# Altium schematic sheet EthIO_03_Ethernet.SchDoc
size A4; SheetNumber: 7; SheetTotal: 8
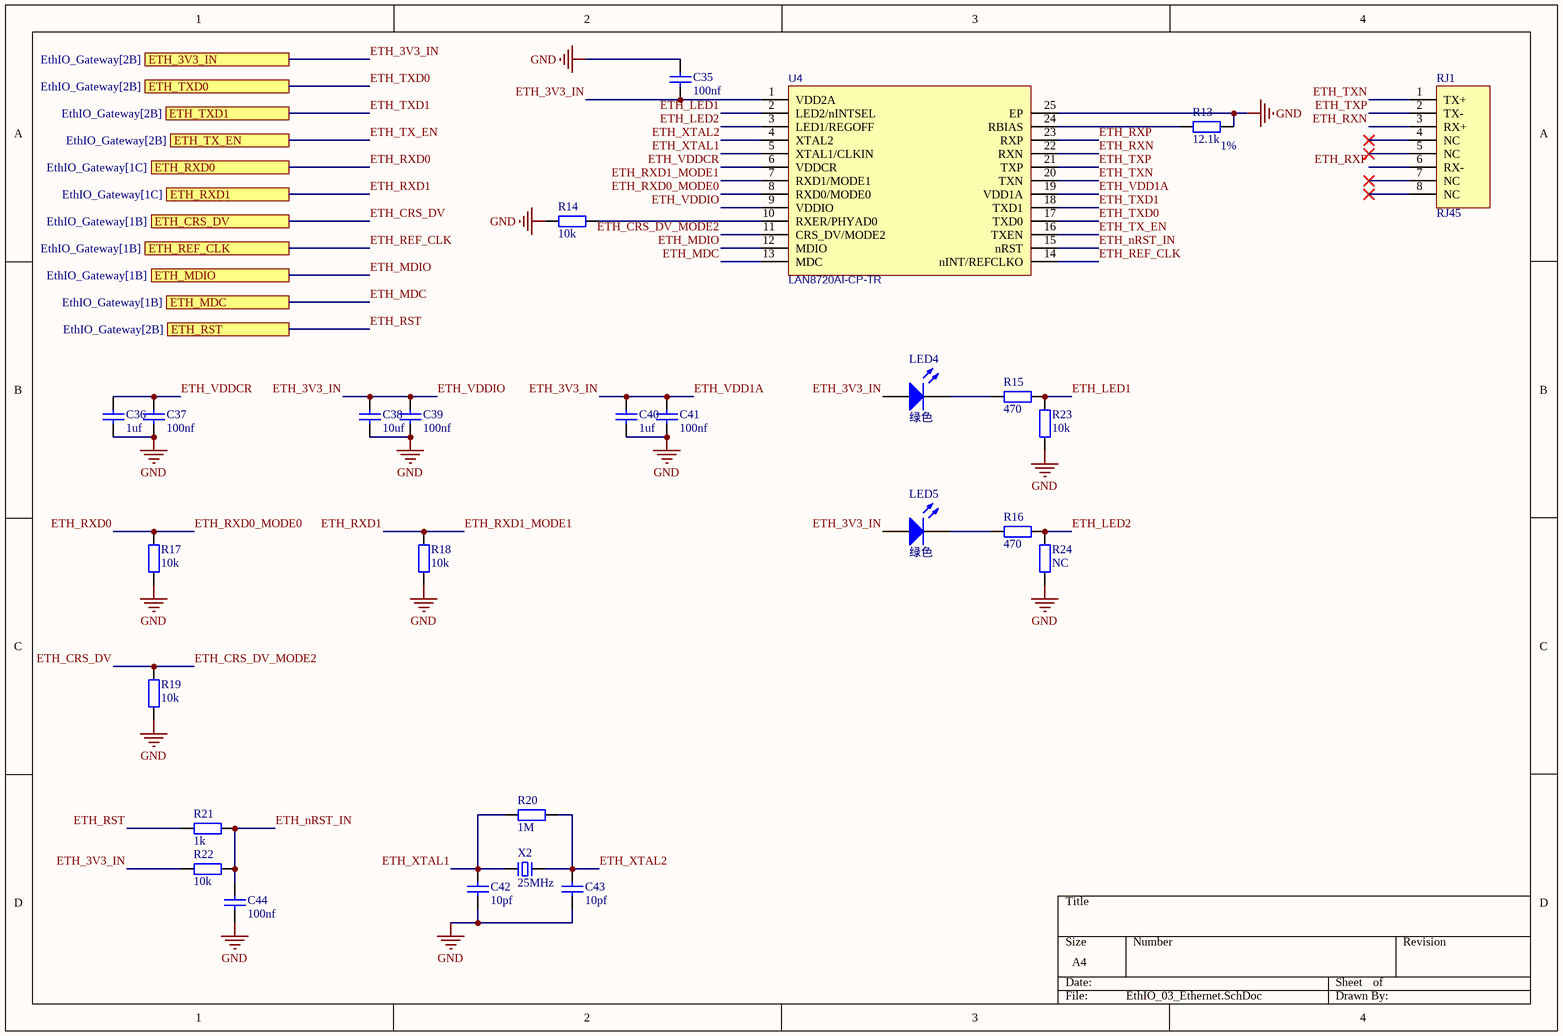
[diagram p0: EthIO_03_Ethernet.SchDoc]

## Parts
C35  100nf  [C0805_L]
C36  1uf  [C0805_L]
C37  100nf  [C0805_L]
C38  10uf  [C0805_L]
C39  100nf  [C0805_L]
C40  1uf  [C0805_L]
C41  100nf  [C0805_L]
C42  10pf  [C0805_L]
C43  10pf  [C0805_L]
C44  100nf  [C0805_L]
LED4  绿色  [LED0805_G]
LED5  绿色  [LED0805_G]
R13  12.1k  Tolerance: 1%  [R0805_L]
R14  10k  [R0805_L]
R15  470  [R0805_L]
R16  470  [R0805_L]
R17  10k  [R0805_L]
R18  10k  [R0805_L]
R19  10k  [R0805_L]
R20  1M  [R0805_L]
R21  1k  [R0805_L]
R22  10k  [R0805_L]
R23  10k  [R0805_L]
R24  NC  [R0805_L]
RJ1  RJ45  [RJ45-2]
U4  LAN8720AI-CP-TR  [QFN24 4x4_N]
X2  25MHz  [HC-49S]

## Ports
ETH_3V3_IN (see EthIO_Gateway[2B]), ETH_CRS_DV (see EthIO_Gateway[1B]), ETH_MDC (see EthIO_Gateway[1B]), ETH_MDIO (see EthIO_Gateway[1B]), ETH_REF_CLK (see EthIO_Gateway[1B]), ETH_RST (see EthIO_Gateway[2B]), ETH_RXD0 (see EthIO_Gateway[1C]), ETH_RXD1 (see EthIO_Gateway[1C]), ETH_TX_EN (see EthIO_Gateway[2B]), ETH_TXD0 (see EthIO_Gateway[2B]), ETH_TXD1 (see EthIO_Gateway[2B])

## Nets
GND: C35.1 C36.2 C37.2 C38.2 C39.2 C40.2 C41.2 C42.2 C43.2 C44.2 R13.1 R14.2 R17.1 R18.1 R19.1 R23.1 R24.1 U4.25(EP)
ETH_3V3_IN: C35.2 C38.1 C39.1 C40.1 C41.1 LED4.1(A) LED5.1(A) R22.1 U4.1(VDD2A) U4.9(VDDIO) U4.19(VDD1A) ; port ETH_3V3_IN  [also labelled ETH_VDD1A, ETH_VDDIO]
ETH_CRS_DV: R19.2 U4.11(CRS_DV/MODE2) ; port ETH_CRS_DV  [also labelled ETH_CRS_DV_MODE2]
ETH_LED1: R15.1 R23.2 U4.2(LED2/nINTSEL)
ETH_LED2: R16.1 R24.2 U4.3(LED1/REGOFF)
ETH_MDC: U4.13(MDC) ; port ETH_MDC
ETH_MDIO: U4.12(MDIO) ; port ETH_MDIO
ETH_nRST_IN: C44.1 R21.2 R22.2 U4.15(nRST)
ETH_REF_CLK: U4.14(nINT/REFCLKO) ; port ETH_REF_CLK
ETH_RST: R21.1 ; port ETH_RST
ETH_RXD0: R17.2 U4.8(RXD0/MODE0) ; port ETH_RXD0  [also labelled ETH_RXD0_MODE0]
ETH_RXD1: R18.2 U4.7(RXD1/MODE1) ; port ETH_RXD1  [also labelled ETH_RXD1_MODE1]
ETH_RXN: RJ1.3(RX+) U4.22(RXN)
ETH_RXP: RJ1.6(RX-) U4.23(RXP)
ETH_TX_EN: U4.16(TXEN) ; port ETH_TX_EN
ETH_TXD0: U4.17(TXD0) ; port ETH_TXD0
ETH_TXD1: U4.18(TXD1) ; port ETH_TXD1
ETH_TXN: RJ1.1(TX+) U4.20(TXN)
ETH_TXP: RJ1.2(TX-) U4.21(TXP)
ETH_VDDCR: C36.1 C37.1 U4.6(VDDCR)
ETH_XTAL1: C42.1 R20.1 U4.5(XTAL1/CLKIN) X2.1
ETH_XTAL2: C43.1 R20.2 U4.4(XTAL2) X2.2
NetLED4_2: LED4.2(K) R15.2
NetLED5_2: LED5.2(K) R16.2
NetR13_2: R13.2 U4.24(RBIAS)
NetR14_1: R14.1 U4.10(RXER/PHYAD0)

Not connected (* = marked no-connect by the designer): RJ1 4(NC)* 5(NC)* 7(NC)* 8(NC)*

## Library data of the parts
C35-C44 = C: 贴片电容/MLCC电容; BOM名称: 无极性贴片电容; 当前库版本V2022.12.25 @淘宝卖家:黄晶宝石: 最新版本发布https://shop463601444.taobao.com
LED4 LED5 = LED: 贴片LED; 封装库来自淘宝卖家：黄晶宝石: 其他店铺购入均为盗版封装库，无更新权益，请立即申请退款，本店现金奖励200~1000元; BOM名称: 贴片LED
R13 = R: 贴片电阻; BOM名称: 贴片电阻
R14-R24 = R: 贴片电阻; 联系下单店铺卖家 免费帮你查找封装: 联系下单店铺卖家 免费技术支持; BOM名称: 贴片电阻
RJ1 = RJ45: 以太网接口; 当前库版本V2022.12.25 @淘宝卖家:黄晶宝石: 最新版本发布https://shop463601444.taobao.com; BOM名称: 以太网接口
U4 = LAN8720AI-CP-TR: 100M 以太网PHY; 芯片厂商: SMSC; 封装库来自淘宝卖家：黄晶宝石: 其他店铺购入均为盗版封装库，无更新权益，退款现金奖励200~1000元; 当前库版本V2022.12.25 @淘宝卖家:黄晶宝石: 最新版本发布https://shop463601444.taobao.com
X2 = XTAL-2P: 2脚无源晶振(谐振器）; 联系下单店铺卖家 免费帮你查找封装: 联系下单店铺卖家 免费技术支持; BOM名称: 2脚无源晶振(谐振器）